# Altium project XY plaat.PrjPCB
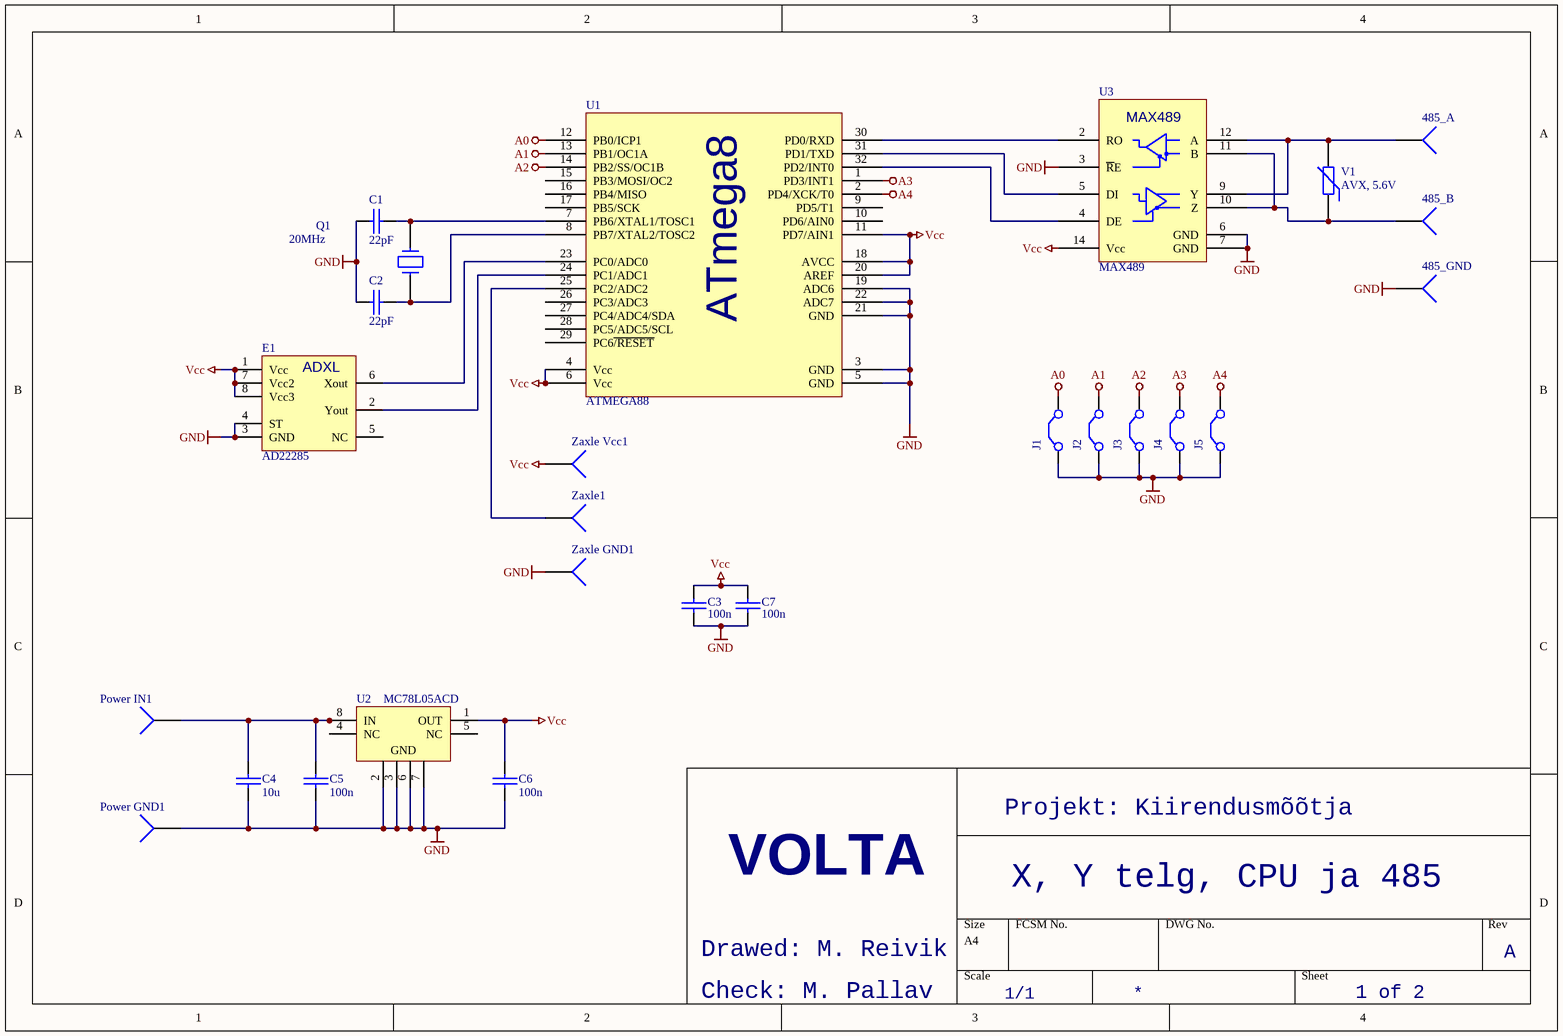
[diagram p0: XY plaat.SchDoc]
1 sheet, 26 parts. Net scope: global (net labels, ports and power ports of the same name join across sheets).
Board file: XY plaat.PcbDoc

## Sheet XY plaat.SchDoc
size A4

### Parts
485_A  Socket  [MW]  (value not drawn)
485_B  Socket  [MW]  (value not drawn)
485_GND  Socket  [MW]  (value not drawn)
C1  22pF  [0805]
C2  22pF  [0805]
C3  100n  [CR1608-0603]
C4  10u  [1210]
C5  100n  [CR1608-0603]
C6  100n  [CR1608-0603]
C7  100n  [CR1608-0603]
E1  AD22285  [ADXL]
J1  Jumper  [CR1608-0603]  (value not drawn)
J2  Jumper  [CR1608-0603]  (value not drawn)
J3  Jumper  [CR1608-0603]  (value not drawn)
J4  Jumper  [CR1608-0603]  (value not drawn)
J5  Jumper  [CR1608-0603]  (value not drawn)
Power_GND1  Socket  [MW]  (value not drawn)
Power_IN1  Socket  [MW]  (value not drawn)
Q1  20MHz  [quartz2]
U1  ATMEGA88  [TQFP32]
U2  MC78L05ACD  [SOIC127P600-8AN]
U3  MAX489  [SOIC127P602-16AN]
V1  AVX, 5.6V  [1206]
Zaxle1  Socket  [MW]  (value not drawn)
Zaxle_GND1  Socket  [MW]  (value not drawn)
Zaxle_Vcc1  Socket  [MW]  (value not drawn)

### Nets
A0: J1.2(C2) U1.12(PB0/ICP1)
A1: J2.2(C2) U1.13(PB1/OC1A)
A2: J3.2(C2) U1.14(PB2/SS/OC1B)
A3: J4.2(C2) U1.1(PD3/INT1)
A4: J5.2(C2) U1.2(PD4/XCK/T0)
GND: 485_GND.1 C1.1 C2.1 C3.1 C4.1 C5.1 C6.1 C7.1 E1.3(GND) E1.4(ST) J1.1(C1) J2.1(C1) J3.1(C1) J4.1(C1) J5.1(C1) Power_GND1.1 U1.3(GND) U1.5(GND) U1.19(ADC6) U1.21(GND) U1.22(ADC7) U2.2(GND) U2.3(GND) U2.6(GND) U2.7(GND) U3.3(~{R}E) U3.6(GND) U3.7(GND) Zaxle_GND1.1
Vcc: C3.2 C6.2 C7.2 E1.1(Vcc) E1.7(Vcc2) E1.8(Vcc3) U1.4(Vcc) U1.6(Vcc) U1.11(PD7/AIN1) U1.18(AVCC) U1.20(AREF) U2.1(OUT) U3.14(Vcc) Zaxle_Vcc1.1
Net485_A_1: 485_A.1 U3.9(Y) U3.12(A) V1.2
Net485_B_1: 485_B.1 U3.10(Z) U3.11(B) V1.1
NetC1_2: C1.2 Q1.2 U1.7(PB6/XTAL1/TOSC1)
NetC2_2: C2.2 Q1.1 U1.8(PB7/XTAL2/TOSC2)
NetC4_2: C4.2 C5.2 Power_IN1.1 U2.8(IN)
NetE1_2: E1.2(Yout) U1.24(PC1/ADC1)
NetE1_6: E1.6(Xout) U1.23(PC0/ADC0)
NetU1_25: U1.25(PC2/ADC2) Zaxle1.1
NetU1_30: U1.30(PD0/RXD) U3.2(RO)
NetU1_31: U1.31(PD1/TXD) U3.5(DI)
NetU1_32: U1.32(PD2/INT0) U3.4(DE)

Not connected (* = marked no-connect by the designer): E1 5(NC); U1 9(PD5/T1) 10(PD6/AIN0) 15(PB3/MOSI/OC2) 16(PB4/MISO) 17(PB5/SCK) 26(PC3/ADC3) 27(PC4/ADC4/SDA) 28(PC5/ADC5/SCL) 29(PC6~{/RESET}); U2 4(NC) 5(NC)

### Notes on the sheet
- Projekt: Kiirendusmõõtja
- VOLTA
- X, Y telg, CPU ja 485
- Drawed: M. Reivik
- A
- Check: M. Pallav
- 1/1
- 1 of 2
- (in symbol AD22285) ADXL
- (in symbol ATMEGA8) ATmega8

### Library data of the parts
C1-C7 = CAP: Capacitor
E1 = AD22285: Accelerometer
J1-J5 = Jumper: Jumper Wire; Published: 24-Mar-1999; LatestRevisionDate: 17-Jul-2002; LatestRevisionNote: Re-released for DXP Platform.; PackageReference: RAD-0.2; Publisher: Altium Limited
Q1 = CRYSTAL
U1 = ATMEGA8
U2 = MC78L05ACD: 3-Terminal Low-Current Positive Fixed Voltage Regulator; Published: 17-Jul-2002; LatestRevisionDate: 13-Apr-2006; LatestRevisionNote: IPC-7351 Footprint Added.; DatasheetVersion: 1988; PackageReference: 751-02; Publisher: Altium Limited; PackageDescription: 8-Pin Small Outline Integrated Circuit 1.27 mm Pitch; Code_JEDEC: MS-012-AA; Code_IPC: SOIC127P600-8; ComponentLink1Description: Manufacturer Link; ComponentLink1URL: http://www.onsemi.com/site/products/taxonomy/0,4438,503,00.html; ComponentLink2Description: Datasheet; ComponentLink2URL: http://www.onsemi.com/pub/Collateral/MC78L00A-D.PDF
V1 = Res Varistor: Varistor (Voltage-Sensitive Resistor); Manufacturer: Generic Components; Class I: Discrete; Published: 24-Mar-1999; Revision: July-2002: Re-released for DXP Platform.; Publisher: Altium Limited; Class II: Voltage-Sensitive Resistor
485_A 485_B 485_GND Power_GND1 Power_IN1 Zaxle1 Zaxle_GND1 Zaxle_Vcc1 = Socket: LatestRevisionDate: 17-Jul-2002; LatestRevisionNote: Re-released for DXP Platform.; Publisher: Altium Limited